# EAGLE design K-Diag small- single (EAGLE 6.5.0)
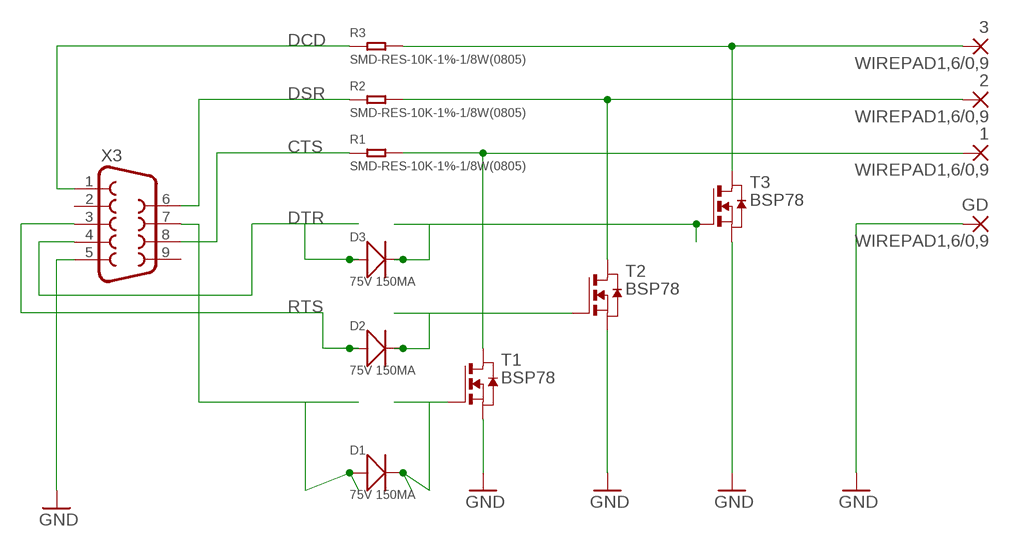
[diagram p0: schematic, sheet 1]

## Parts
1  WIREPAD1,6/0,9  [1,6/0,9]
2  WIREPAD1,6/0,9  [1,6/0,9]
3  WIREPAD1,6/0,9  [1,6/0,9]
D1  75V 150MA  SMD-DIODE-SWITCHING-75V-150MA(D1206)  [LED-1206]
D2  75V 150MA  SMD-DIODE-SWITCHING-75V-150MA(D1206)  [LED-1206]
D3  75V 150MA  SMD-DIODE-SWITCHING-75V-150MA(D1206)  [LED-1206]
GD  WIREPAD1,6/0,9  [1,6/0,9]
R1  SMD-RES-10K-1%-1/8W(0805)  [R0805]
R2  SMD-RES-10K-1%-1/8W(0805)  [R0805]
R3  SMD-RES-10K-1%-1/8W(0805)  [R0805]
T1  BSP78  NMOSSOT223  [SOT223]
T2  BSP78  NMOSSOT223  [SOT223]
T3  BSP78  NMOSSOT223  [SOT223]
X3  F09D  [F09D]

## Nets
CTS: R1.1 X3.8
DCD: R3.1 X3.1
DSR: R2.1 X3.6
DTR: D3.+ X3.4
GND: GD.1(P) T1.3(S) T2.3(S) T3.3(S) X3.5
N$1: D3.- T3.1(G)
N$2: D2.- T2.1(G)
N$3: D1.- T1.1(G)
N$4: 1.1(P) R1.2 T1.2(D) T1.4(D)
N$5: 2.1(P) R2.2 T2.2(D) T2.4(D)
N$6: 3.1(P) R3.2 T3.2(D) T3.4(D)
N$7: D1.+ X3.7
RTS: D2.+ X3.3
Unconnected: X3.2 X3.9

## Library data of the parts
1-3 GD = wirepad:WIREPAD: Wire PAD connect wire on PCB
D1-D3 = Seeed-Diode-2016:SMD-DIODE-SWITCHING-75V-150MA(D1206): 304040005; MPN: CD1206-S01575
R1-R3 = Seeed-Resistor-2016:SMD-RES-10K-1%-1/8W(0805): 301010361; MPN: RC0805FR-0710KL; VALUE: 10K
T1-T3 = zetex_nmos_BSP78:NMOSSOT223: MOS FET; OC_FARNELL: unknown; OC_NEWARK: unknown
X3 = con-subd_Kdiag:F09: SUB-D; OC_FARNELL: unknown; OC_NEWARK: unknown

## Board
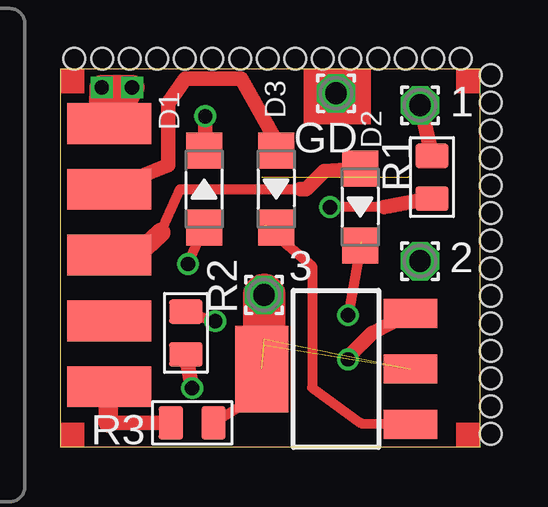
[diagram p1: board, top side]
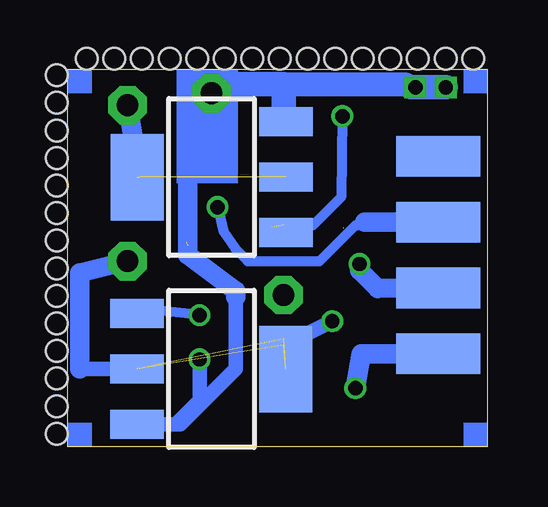
[diagram p2: board, bottom side, seen from below]

Size 17.49 x 15.75 mm. Coordinates in mm from the lower left corner, seen from the top.
Outline: 0,0 17.49,0 17.49,15.75 0,15.75 0,0
Copper layers (1*16): Top 0.035mm / dielectric 1.5mm / Bottom 0.035mm
Design rules "SeeedStudio_2layer_DRU_no_angle_20140221": minimum track width 6mil, minimum drill 12mil, track to track 6mil, track to pad 6mil, pad to pad 6mil, via to via 6mil, smd to smd 0mil, copper to edge 10mil, drill to drill 10mil, minimum pad ring 10mil, minimum via ring 6mil, stop-mask expansion 2mil, vias tented up to drill 100mil, thermal gap 10mil
Holes 0.9 mm at 17.94,0.55 17.94,1.7 17.94,2.85 17.94,4 17.94,5.15 17.94,6.3 17.94,7.45 17.94,8.6 17.94,9.75 17.94,10.9 17.94,12.05 17.94,13.2 17.94,14.35 17.94,15.5 0.59,16.2 0.59,16.2 1.74,16.2 2.89,16.2 4.04,16.2 5.19,16.2 6.34,16.2 7.49,16.2 8.64,16.2 9.79,16.2 10.94,16.2 12.09,16.2 13.24,16.2 14.39,16.2 15.54,16.2 16.69,16.2

### Footprints (pad centres in the part's own frame; a part is rotated, then mirrored left to right if it is on the bottom)
1,6/0,9 = drill 0.914 pad 1.6 octagon: 1 0,0
LED-1206 = smd 1.5 x 1.5: + -1.6,0; - 1.6,0
R0805 = smd 1.397 x 1.016: 1 0,0.889; 2 0,-0.889
SOT223 = smd 1.219 x 2.235: 1 -2.311,-3.099; 2 0,-3.099; 3 2.311,-3.099 | smd 3.6 x 2.2: 4 0,3.099
F09D = smd 1.7 x 3.5: 1 -5.486,-6.045; 2 -2.743,-6.045; 3 0,-6.045; 4 2.743,-6.045; 5 5.486,-6.045 | smd 1.7 x 3.5 bottom: 6 -4.115,-6.045; 7 -1.372,-6.045; 8 1.372,-6.045; 9 4.115,-6.045

### Placement (x,y rotation side)
1  14.99,14.25 0 top
2  14.99,7.75 0 top
3  8.49,6.34 0 top
D1  5.99,10.75 90 top
D2  12.49,10 270 top
D3  8.99,10.75 270 top
GD  11.49,14.75 0 top
R1  15.49,11.25 180 top
R2  5.24,4.75 180 top
R3  5.5,1 90 top
T1  11.49,11.25 90 bottom
T2  11.49,3.25 270 bottom
T3  11.49,3.25 90 top
X3  -4.01,8 90 top

### Tracks (layer width: path | path; a pad name or v marks a point on that pad's centre or on a via)
CTS  (via drill 0.6)
  Top 0.406: 13.49,10 v11.24,10
  Top 0.61: R1.1 15.04,10.3 13.49,10
  Bottom 0.406: v11.24,10 11,9 10.49,8.25 9.99,7.75 6.99,7.75 5.49,9.25 5.24,9.25 5.11,9.37
  Bottom 0.813: X3.8 5.11,9.37
DCD
  Top 0.406: 2.27,2.75 X3.1
  Top 0.61: R3.1 1.99,1
  Top 0.813: 1.99,1 1.99,2.25 2.27,2.75
DSR  (via drill 0.6)
  Top 0.61: v5.5,2.45 R2.1
  Bottom 0.813: X3.6 5.25,3.88 v5.5,2.45
DTR
  Top 0.406: 2.04,10.75 X3.4
  Top 0.61: 2.04,10.75 4.49,11.75 4.49,14.33 5.22,15.35 7.54,15.35 8.99,12.75 D3.+
GND  (via drill 0.6)
  Top 0.406: X3.5 2.23,13.49 | 11.99,3.75 v11.99,3.65
  Top 0.61: T3.3 12.99,4.75 11.99,3.75
  Top 1.016: 2.73,13.49 2.23,13.49 v3,15 | 2.99,15.01 v1.73,15 1.72,14.25
  Bottom 0.61: T2.3 12.99,0.94 | 12.99,0.94 12.8,0.94 10.49,3.25 10.49,6.25 | v11.99,3.65 11.99,1.94 12.99,0.94
  Bottom 0.813: 10.49,6.25 10.49,6.5 12.49,8 12.49,14.25 GD.1
  Bottom 1.016: 8.49,15.12 3.42,15.12 3.17,15 v3,15 v1.73,15 | T1.3 8.49,13.56 8.49,15.12 | 8.49,15.12 10.99,15.12 GD.1
N$1  (1 unrouted)
  Top 0.406: 8.49,9.25 10.49,7.54 10.49,2.47 12.53,0.99 T3.1
N$2  (via drill 0.6)  (1 unrouted)
  Top 0.406: 12.54,8.55 v11.99,5.5
  Bottom 0.406: v11.99,5.5 14.4,5.75 T2.1
N$3  (via drill 0.6)
  Top 0.61: v6.04,13.79 6.04,12.8 D1.-
  Bottom 0.406: v6.04,13.79 6.09,10.42 7.25,9.25 8.21,9.25 T1.1
N$4  (2 unrouted)
  Top 0.61: R1.2 1.1
  Bottom 0.813: 14.49,11.25 1.1
N$5  (via drill 0.6)  (2 unrouted)
  Top 0.406: R2.2 v6.46,5.24
  Bottom 0.61: v6.46,5.24 8.49,4.25 | 16.99,3.25 T2.2
  Bottom 0.813: 2.1 16.99,7.25 16.99,3.25
N$6  (2 unrouted)
  Top 0.406: R3.2 7.99,2.01
  Top 0.61: 7.99,2.01 8.49,4.5
  Top 1.778: 3.1 8.49,4.5
N$7  (via drill 0.6)  (1 unrouted)
  Top 0.406: v5.32,7.63 5.99,9.13 5.99,9.25
  Bottom 0.813: X3.7 4.56,6.61 5.32,7.36 v5.32,7.63
RTS
  Top 0.406: 4.19,8.95 4.99,10.75 9.99,10.75
  Top 0.61: 9.99,10.75 10.24,10.75 10.99,11.5 D2.+
  Top 0.813: X3.3 3.19,8 4.19,8.95
(copper drawn outside any net)
  shapes: Bottom area x5, Top area x5